# EAGLE design CrazyPong (EAGLE 9.0.0)
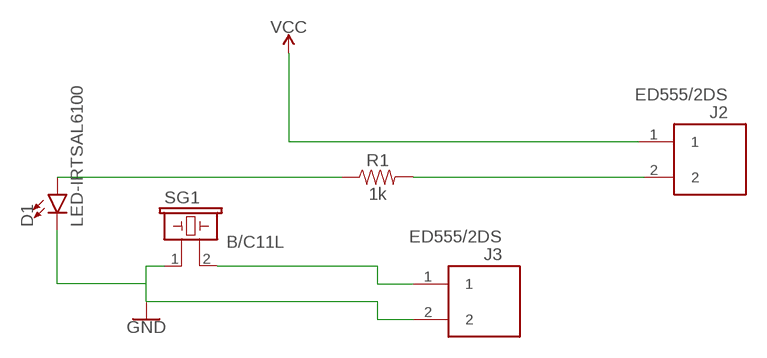
[diagram p0: schematic, sheet 1]

## Parts
D1  LED-IRTSAL6100  [LED_5MM]
J2  ED555/2DS  [ED555/2DS]
J3  ED555/2DS  [ED555/2DS]
R1  1k  1KOHM-HORIZ_KIT-1/4W-1%  [AXIAL-0.3-KIT]
SG1  B/C11L  [B/C11L]

## Nets
GND: D1.K(C) J3.2 SG1.1
N$1: J3.1 SG1.2
N$2: D1.A R1.P$1
N$4: R1.P$2
VCC: J2.1
Unconnected: J2.2

## Library data of the parts
D1 = SparkFun-LED:LED-IR: Infrared LED (IR) Wavelength: 940nm Packages: TSAL6100 LTE302 - Side firing. Check SparkFun-Sensors.lbr for the receiver SparkFun Products: ZX Distance and Gesture Sensor <[https://www.sparkfun.com/products/12780]> Infrared Emitters and Detectors <https://www.sparkfun.com/products/241>; PROD_ID: DIO-12058
J2 J3 = DC_LOAD_AU:ED555/2DS: 2-Pin Terminal Block 3.5mm pitch 6A
R1 = SparkFun-Resistors:1KOHM: 1kΩ resistor A resistor is a passive two-terminal electrical component that implements electrical resistance as a circuit element. Resistors act to reduce current flow, and, at the same time, act to lower voltage levels within circuits. - Wikipedia; PROD_ID: RES-12182
SG1 = buzzer:B/C11L: BUZZER Source: Buerklin; OC_FARNELL: unknown; OC_NEWARK: unknown

## Board
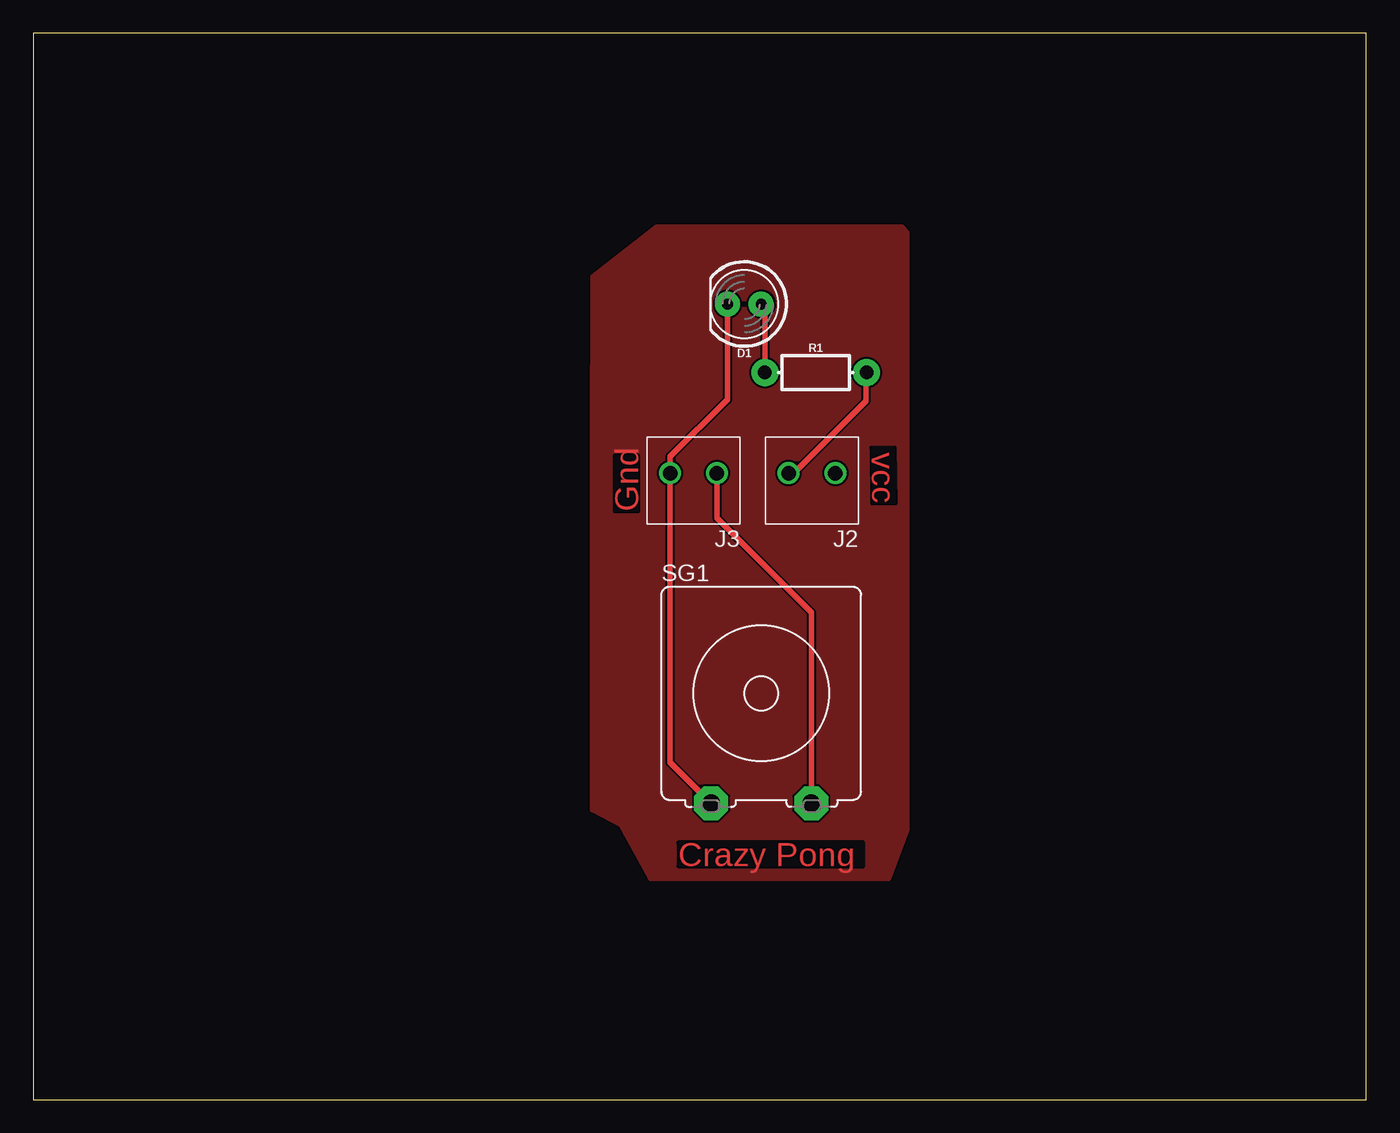
[diagram p1: board, top side]
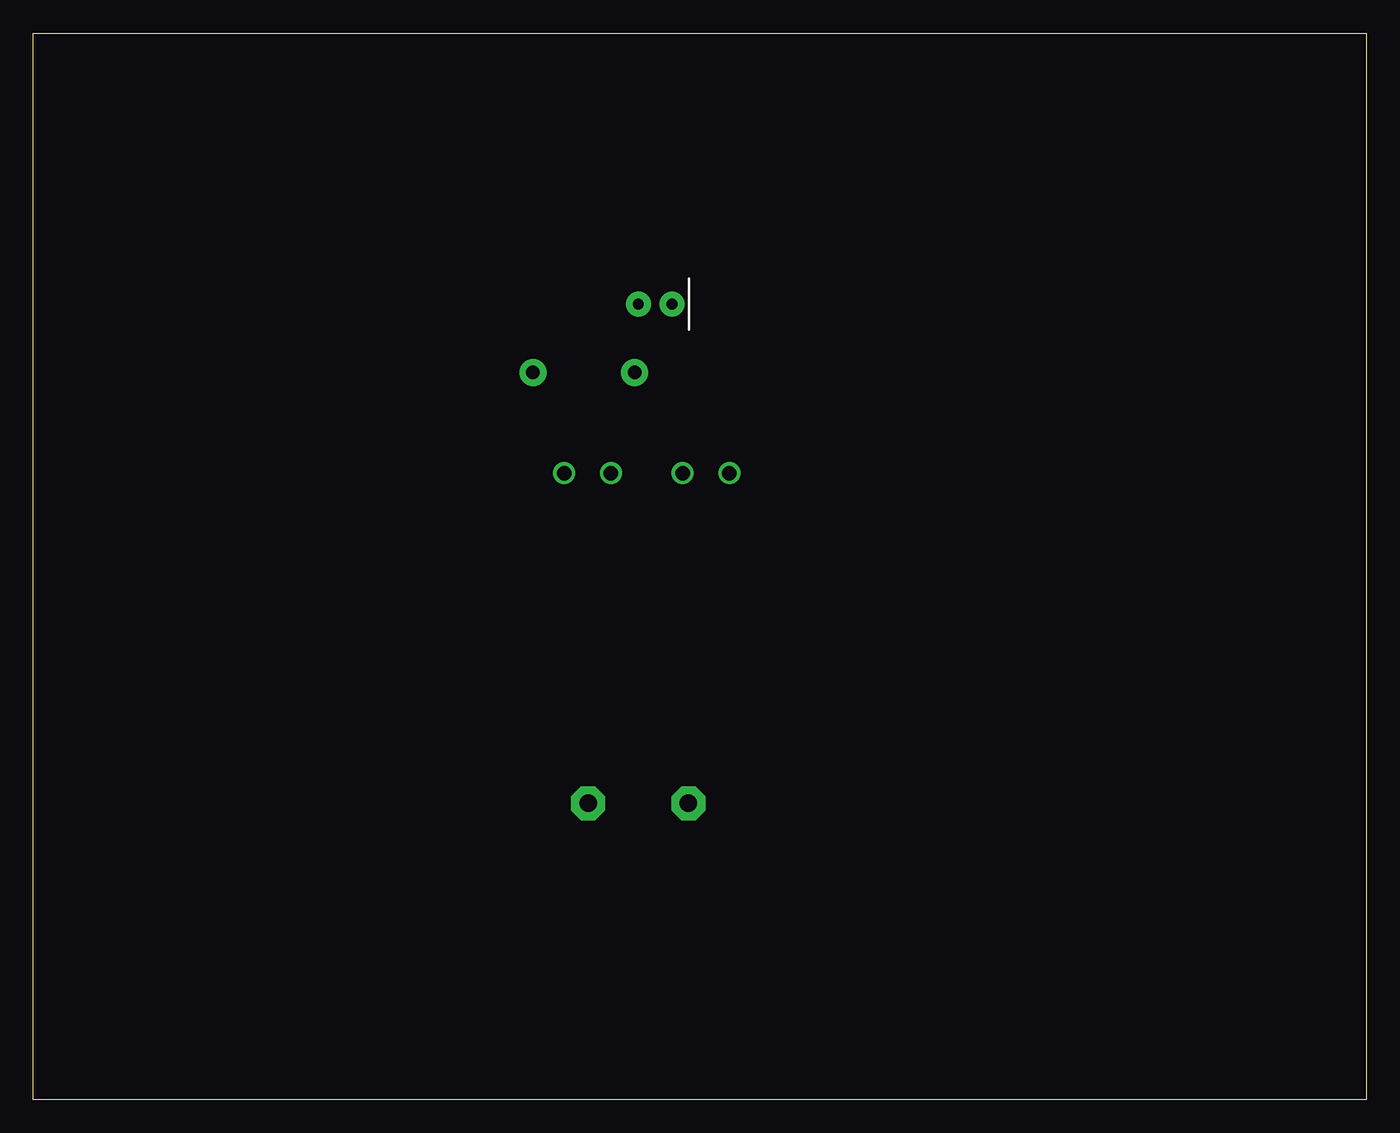
[diagram p2: board, bottom side, seen from below]

Size 100 x 80 mm. Coordinates in mm from the lower left corner, seen from the top.
Outline: 0,0 100,0 100,80 0,80 0,0
Copper layers (1*16): Top 0.035mm / dielectric 1.5mm / Bottom 0.035mm
Design rules "default *": minimum track width 6mil, minimum drill 0.35mm, track to track 6mil, track to pad 6mil, pad to pad 6mil, via to via 6mil, smd to smd 6mil, copper to edge 40mil, drill to drill 6mil, minimum pad ring 10mil, minimum via ring 8mil, stop-mask expansion 4mil, vias tented up to drill 0mil, thermal gap 16mil

### Footprints (pad centres in the part's own frame; a part is rotated, then mirrored left to right if it is on the bottom)
LED_5MM = drill 0.813 pad 1.88: A -1.27,0; K 1.27,0
ED555/2DS = drill 1.1: 1 -1.75,0; 2 1.75,0
AXIAL-0.3-KIT = drill 1.016 pad 2.032: P$1 -3.81,0; P$2 3.81,0
B/C11L = drill 1.321 pad 2.54 octagon: 1 -3.759,-8.255; 2 3.759,-8.255

### Placement (x,y rotation side)
D1  53.34,59.69 180 top
J2  58.42,46.99 180 top
J3  49.53,46.99 180 top
R1  58.7,54.55 0 top
SG1  54.61,30.48 0 top

### Tracks (layer width: path | path; a pad name or v marks a point on that pad's centre or on a via)
GND
  Top 0.406: D1.K 52.07,52.52 47.78,48.23 J3.2 47.78,25.3 SG1.1
N$1
  Top 0.406: J3.1 51.28,43.62 58.37,36.53 SG1.2
N$2
  Top 0.406: R1.P$1 54.89,59.41 D1.A
N$3
  pour Top: 42,54.85 42,61.75 46.75,65.45 65.15,65.45 65.55,65.05 65.55,20.3 64.15,16.6 46.3,16.6 44.1,20.6 41.95,21.75 41.95,55.05
N$5
  Top 0.406: 57.15,47.1 62.45,52.4 62.45,54.45

### Text on the board
Top: vcc | Gnd | Crazy Pong